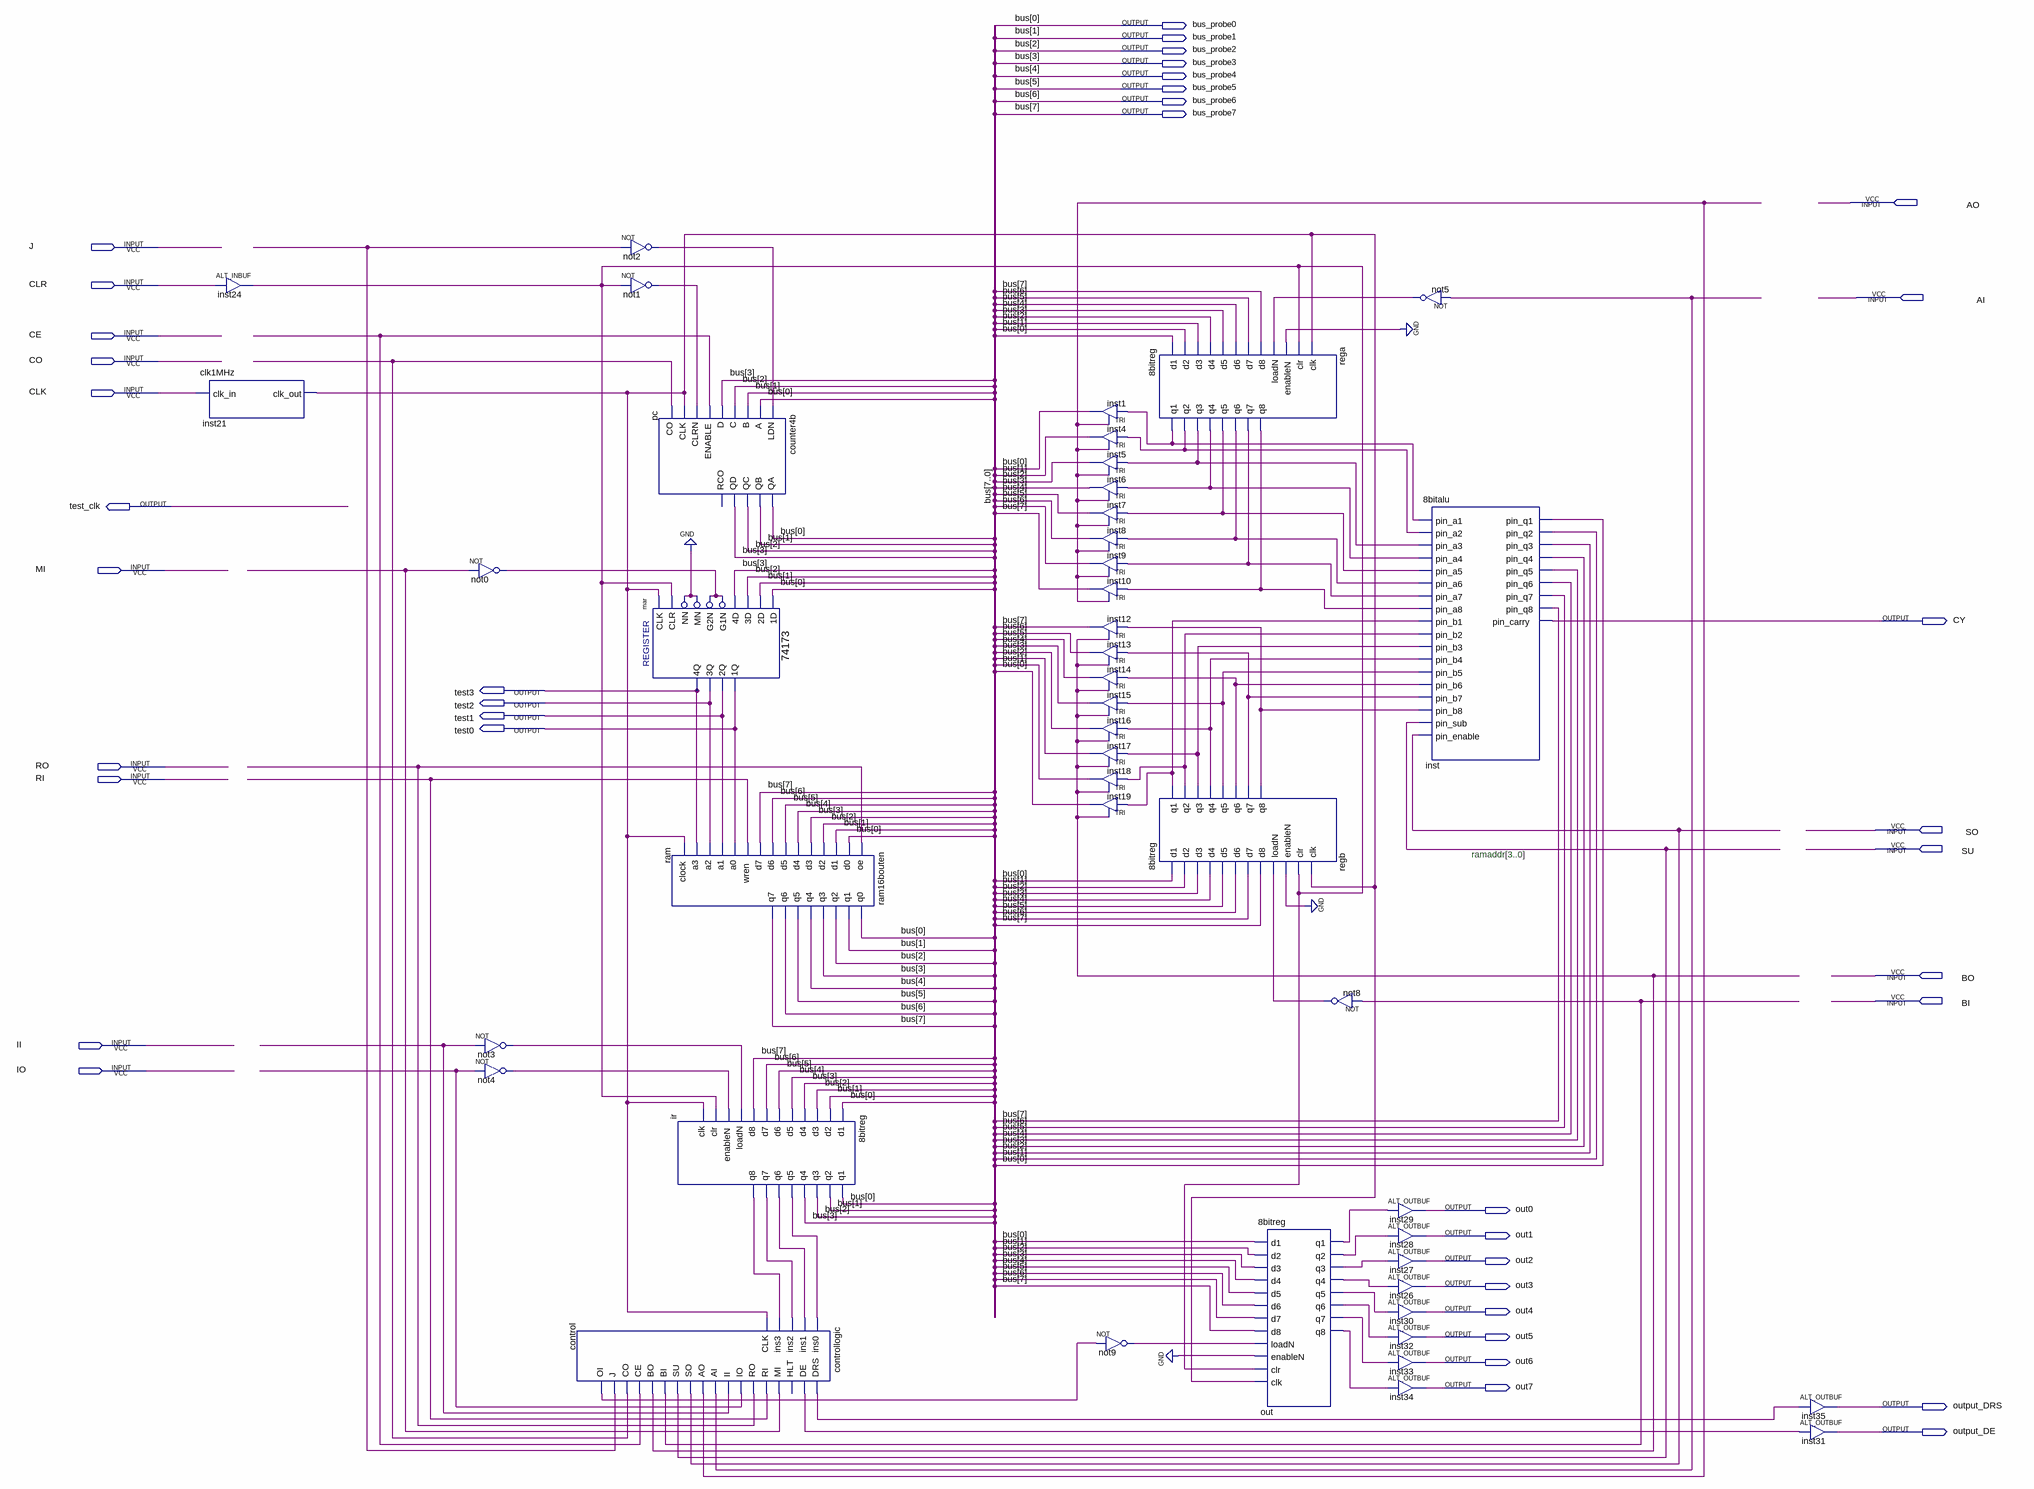
[diagram p0: schematic sheet]
// Quartus schematic testcpu3.bdf as structural Verilog: 45 symbols, 40 pins
module testcpu3 (
  input  AO,
  input  J,
  input  CLR,
  input  AI,
  input  CE,
  input  CO,
  input  CLK,
  input  MI,
  input  RO,
  input  RI,
  input  SO,
  input  SU,
  input  BO,
  input  BI,
  input  II,
  input  IO,
  output bus_probe0,
  output bus_probe1,
  output bus_probe2,
  output bus_probe3,
  output bus_probe4,
  output bus_probe5,
  output bus_probe6,
  output bus_probe7,
  output test_clk,
  output CY,
  output test3,
  output test2,
  output test1,
  output test0,
  output out0,
  output out1,
  output out2,
  output out3,
  output out4,
  output out5,
  output out6,
  output out7,
  output output_DRS,
  output output_DE
);

  wire control_ai, control_ao, control_bi, control_bo, control_ce, control_co, control_de, control_drs,
       control_ii, control_io, control_j, control_mi, control_oi, control_ri, control_ro, control_so,
       control_su, inst21_clk_out, inst24_o, ir_q5, ir_q6, ir_q7, ir_q8, not0_out, not1_out, not2_out,
       not3_out, not4_out, not5_out, not8_out, not9_out, out_q1, out_q2, out_q3, out_q4, out_q5, out_q6,
       out_q7, out_q8, rega_q1, rega_q2, rega_q3, rega_q4, rega_q5, rega_q6, rega_q7, rega_q8, regb_q1,
       regb_q2, regb_q3, regb_q4, regb_q5, regb_q6, regb_q7, regb_q8;

  clk1MHz inst21 (.clk_in(CLK), .clk_out(inst21_clk_out));
  ALT_INBUF inst24 (.i(CLR), .o(inst24_o));
  not not0 (not0_out, control_mi);
  not not3 (not3_out, control_ii);
  not not4 (not4_out, control_io);
  controllogic control (
    .ins0(ir_q5), .ins1(ir_q6), .ins2(ir_q7), .ins3(ir_q8), .CLK(inst21_clk_out), .DRS(control_drs),
    .DE(control_de), .MI(control_mi), .RI(control_ri), .RO(control_ro), .IO(control_io), .II(control_ii),
    .AI(control_ai), .AO(control_ao), .SO(control_so), .SU(control_su), .BI(control_bi), .BO(control_bo),
    .CE(control_ce), .CO(control_co), .J(control_j), .OI(control_oi));  // open: HLT
  not not2 (not2_out, control_j);
  not not1 (not1_out, inst24_o);
  counter4b pc (
    .LDN(not2_out), .A(bus_probe0), .B(bus_probe1), .C(bus_probe2), .D(bus_probe3), .ENABLE(control_ce),
    .CLRN(not1_out), .CLK(inst21_clk_out), .CO(control_co), .QA(bus_probe0), .QB(bus_probe1),
    .QC(bus_probe2), .QD(bus_probe3));  // open: RCO
  \74173  mar (
    .\3D (bus_probe2), .MN(1'b0), .\1D (bus_probe0), .\2D (bus_probe1), .\4D (bus_probe3), .G1N(not0_out),
    .G2N(not0_out), .NN(1'b0), .CLR(inst24_o), .CLK(inst21_clk_out), .\3Q (test2), .\2Q (test1),
    .\1Q (test0), .\4Q (test3));
  ram16bouten ram (
    .oe(control_ro), .d0(bus_probe0), .d1(bus_probe1), .d2(bus_probe2), .d3(bus_probe3), .d4(bus_probe4),
    .d5(bus_probe5), .d6(bus_probe6), .d7(bus_probe7), .wren(control_ri), .a0(test0), .a1(test1), .a2(test2),
    .a3(test3), .clock(inst21_clk_out), .q0(bus_probe0), .q1(bus_probe1), .q2(bus_probe2), .q3(bus_probe3),
    .q4(bus_probe4), .q5(bus_probe5), .q6(bus_probe6), .q7(bus_probe7));
  \8bitreg  ir (
    .d1(bus_probe0), .d2(bus_probe1), .d3(bus_probe2), .d4(bus_probe3), .d5(bus_probe4), .d6(bus_probe5),
    .d7(bus_probe6), .d8(bus_probe7), .loadN(not3_out), .enableN(not4_out), .clr(inst24_o),
    .clk(inst21_clk_out), .q1(bus_probe0), .q2(bus_probe1), .q3(bus_probe2), .q4(bus_probe3), .q5(ir_q5),
    .q6(ir_q6), .q7(ir_q7), .q8(ir_q8));
  TRI inst1 (.IN(rega_q1), .OE(control_ao), .OUT(bus_probe0));
  TRI inst4 (.IN(rega_q2), .OE(control_ao), .OUT(bus_probe1));
  TRI inst5 (.IN(rega_q3), .OE(control_ao), .OUT(bus_probe2));
  TRI inst6 (.IN(rega_q4), .OE(control_ao), .OUT(bus_probe3));
  TRI inst7 (.IN(rega_q5), .OE(control_ao), .OUT(bus_probe4));
  TRI inst8 (.IN(rega_q6), .OE(control_ao), .OUT(bus_probe5));
  TRI inst9 (.IN(rega_q7), .OE(control_ao), .OUT(bus_probe6));
  TRI inst10 (.IN(rega_q8), .OE(control_ao), .OUT(bus_probe7));
  TRI inst12 (.IN(regb_q8), .OE(control_bo), .OUT(bus_probe7));
  TRI inst13 (.IN(regb_q7), .OE(control_bo), .OUT(bus_probe6));
  TRI inst14 (.IN(regb_q6), .OE(control_bo), .OUT(bus_probe5));
  TRI inst15 (.IN(regb_q5), .OE(control_bo), .OUT(bus_probe4));
  TRI inst16 (.IN(regb_q4), .OE(control_bo), .OUT(bus_probe3));
  TRI inst17 (.IN(regb_q3), .OE(control_bo), .OUT(bus_probe2));
  TRI inst18 (.IN(regb_q2), .OE(control_bo), .OUT(bus_probe1));
  TRI inst19 (.IN(regb_q1), .OE(control_bo), .OUT(bus_probe0));
  not not9 (not9_out, control_oi);
  \8bitreg  rega (
    .d1(bus_probe0), .d2(bus_probe1), .d3(bus_probe2), .d4(bus_probe3), .d5(bus_probe4), .d6(bus_probe5),
    .d7(bus_probe6), .d8(bus_probe7), .loadN(not5_out), .enableN(1'b0), .clr(inst24_o), .clk(inst21_clk_out),
    .q1(rega_q1), .q2(rega_q2), .q3(rega_q3), .q4(rega_q4), .q5(rega_q5), .q6(rega_q6), .q7(rega_q7),
    .q8(rega_q8));
  \8bitreg  regb (
    .d1(bus_probe0), .d2(bus_probe1), .d3(bus_probe2), .d4(bus_probe3), .d5(bus_probe4), .d6(bus_probe5),
    .d7(bus_probe6), .d8(bus_probe7), .loadN(not8_out), .enableN(1'b0), .clr(inst24_o), .clk(inst21_clk_out),
    .q1(regb_q1), .q2(regb_q2), .q3(regb_q3), .q4(regb_q4), .q5(regb_q5), .q6(regb_q6), .q7(regb_q7),
    .q8(regb_q8));
  \8bitreg  out (
    .d1(bus_probe0), .d2(bus_probe1), .d3(bus_probe2), .d4(bus_probe3), .d5(bus_probe4), .d6(bus_probe5),
    .d7(bus_probe6), .d8(bus_probe7), .loadN(not9_out), .enableN(1'b0), .clr(inst24_o), .clk(inst21_clk_out),
    .q1(out_q1), .q2(out_q2), .q3(out_q3), .q4(out_q4), .q5(out_q5), .q6(out_q6), .q7(out_q7), .q8(out_q8));
  not not8 (not8_out, control_bi);
  not not5 (not5_out, control_ai);
  \8bitalu  inst (
    .pin_a1(rega_q1), .pin_a2(rega_q2), .pin_a3(rega_q3), .pin_a4(rega_q4), .pin_a5(rega_q5),
    .pin_a6(rega_q6), .pin_a7(rega_q7), .pin_a8(rega_q8), .pin_b1(regb_q1), .pin_b2(regb_q2),
    .pin_b3(regb_q3), .pin_b4(regb_q4), .pin_b5(regb_q5), .pin_b6(regb_q6), .pin_b7(regb_q7),
    .pin_b8(regb_q8), .pin_sub(control_su), .pin_enable(control_so), .pin_q1(bus_probe0),
    .pin_q2(bus_probe1), .pin_q3(bus_probe2), .pin_q4(bus_probe3), .pin_q5(bus_probe4), .pin_q6(bus_probe5),
    .pin_q7(bus_probe6), .pin_q8(bus_probe7), .pin_carry(CY));
  ALT_OUTBUF inst29 (.i(out_q1), .o(out0));
  ALT_OUTBUF inst28 (.i(out_q2), .o(out1));
  ALT_OUTBUF inst27 (.i(out_q3), .o(out2));
  ALT_OUTBUF inst26 (.i(out_q4), .o(out3));
  ALT_OUTBUF inst30 (.i(out_q5), .o(out4));
  ALT_OUTBUF inst32 (.i(out_q6), .o(out5));
  ALT_OUTBUF inst33 (.i(out_q7), .o(out6));
  ALT_OUTBUF inst34 (.i(out_q8), .o(out7));
  ALT_OUTBUF inst35 (.i(control_drs), .o(output_DRS));
  ALT_OUTBUF inst31 (.i(control_de), .o(output_DE));

  // Other names for the same wires on the sheet: bus[7:0] = {bus_probe7, bus_probe6, bus_probe5, bus_probe4, bus_probe3, bus_probe2, bus_probe1, bus_probe0}

  // Notes on the sheet:
  //   ramaddr[3..0]
endmodule
